# Altium schematic sheet Heater SCR 030615.SchDoc
size A3
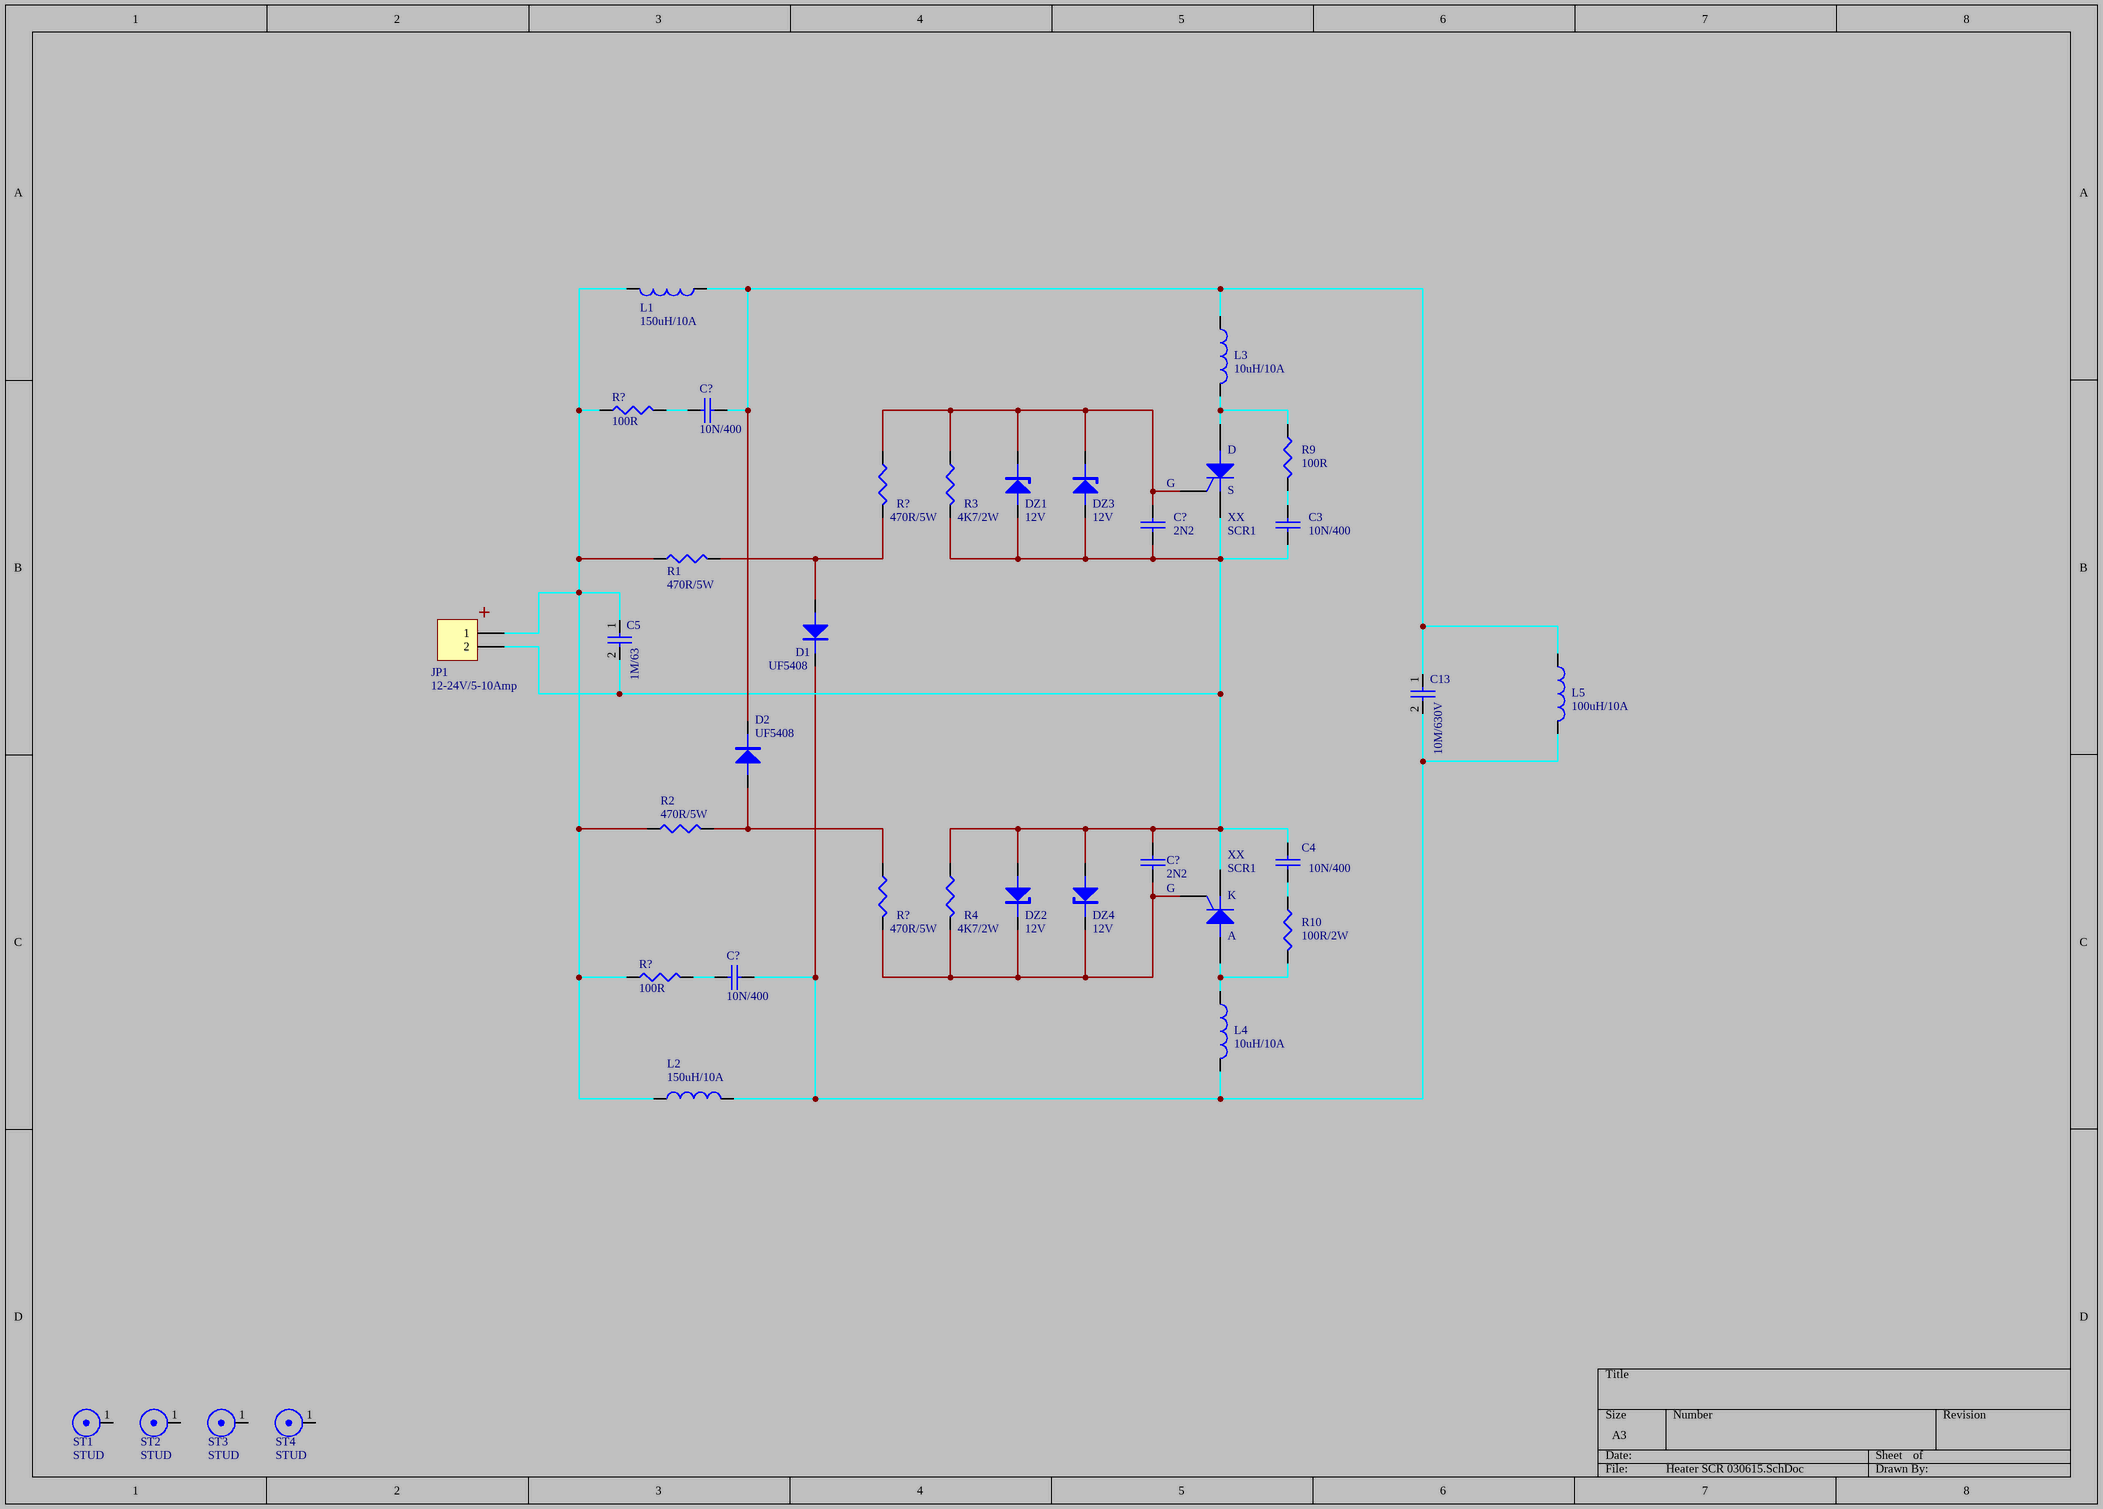
[diagram p0: Heater SCR 030615.SchDoc]

## Parts
(Parts that share a designator on the sheet are numbered #1, #2 ... from top to bottom, then left to right.)
C3  10N/400  [C2P]
C4  10N/400  [C2P]
C5  1M/63  [C3P]
C13  10M/630V  [CV25-8-22]
C?#1  10N/400  [C2P]
C?#2  2N2  [C2P]
C?#3  2N2  [C2P]
C?#4  10N/400  [C2P]
D1  UF5408  [D54]
D2  UF5408  [D54]
DZ1  12V  [D4P]
DZ2  12V  [D4P]
DZ3  12V  [D4P]
DZ4  12V  [D4P]
JP1  12-24V/5-10Amp  [DG55X2]
L1  150uH/10A  [INDU2511]
L2  150uH/10A  [INDU2511]
L3  10uH/10A  [INDU2511]
L4  10uH/10A  [INDU2511]
L5  100uH/10A  [INDU2511]
R1  470R/5W  [W5]
R2  470R/5W  [W5]
R3  4K7/2W  [R4P]
R4  4K7/2W  [R4P]
R9  100R  [W5]
R10  100R/2W  [W5]
R?#1  100R  [W5]
R?#2  470R/5W  [R4P]
R?#3  470R/5W  [R4P]
R?#4  100R  [W5]
ST1  STUD  [CORNER]
ST2  STUD  [CORNER]
ST3  STUD  [CORNER]
ST4  STUD  [CORNER]
XX#1  SCR1  [SCR]
XX#2  SCR1  [SCR]

## Nets
NetC3_1: C3.1 R9.1
NetC3_2: C3.2 C4.2 C5.2 C?#2.2 C?#3.2 DZ1.1(A) DZ2.1(A) DZ3.1(A) DZ4.1(A) JP1.2 R3.2 R4.1 XX#1.3(K) XX#2.3(K)
NetC4_1: C4.1 R10.2
NetC5_1: C5.1 JP1.1 L1.1 L2.1 R1.1 R2.1 R?#1.2 R?#4.2
NetC13_1: C13.1 C?#1.2 D2.2(K) L1.2 L3.2 L5.2
NetC13_2: C13.2 C?#4.2 D1.2(K) L2.2 L4.1 L5.1
NetC?#1_1: C?#1.1 R?#1.1
NetC?#2_1: C?#2.1 DZ1.2(K) DZ3.2(K) R3.1 R?#2.1 XX#1.2(G)
NetC?#3_1: C?#3.1 DZ2.2(K) DZ4.2(K) R4.2 R?#3.2 XX#2.2(G)
NetC?#4_1: C?#4.1 R?#4.1
NetD1_1: D1.1(A) R1.2 R?#2.2
NetD2_1: D2.1(A) R2.2 R?#3.1
NetL3_1: L3.1 R9.2 XX#1.1(A)
NetL4_2: L4.2 R10.1 XX#2.1(A)

Not connected (* = marked no-connect by the designer): ST1 1; ST2 1; ST3 1; ST4 1

## Notes on the sheet
- (near XX#1) D
- G
- (near XX#1) S
- (near JP1) +
- (near C?#3) G
- (near XX#2) K
- (near XX#2) A

## Library data of the parts
C3-C5 C13 C?#1-C?#4 = C
D1 D2 = D: D4P: *
DZ1-DZ4 = DZ
JP1 = Header 2: Header, 2-Pin; LatestRevisionDate: 17-Jul-2002; LatestRevisionNote: Re-released for DXP Platform.; Publisher: Altium Limited
L1-L5 = INDUCTOR
R1-R4 R9 R10 R?#1-R?#4 = R
XX#1 XX#2 = SCR: Silicon Controlled Rectifier; Published: 8-Jun-2000; LatestRevisionDate: 17-Jul-2002; LatestRevisionNote: Re-released for DXP Platform.; PackageReference: TO-220-AB; Publisher: Altium Limited; Code_JEDEC: TO-220-AB